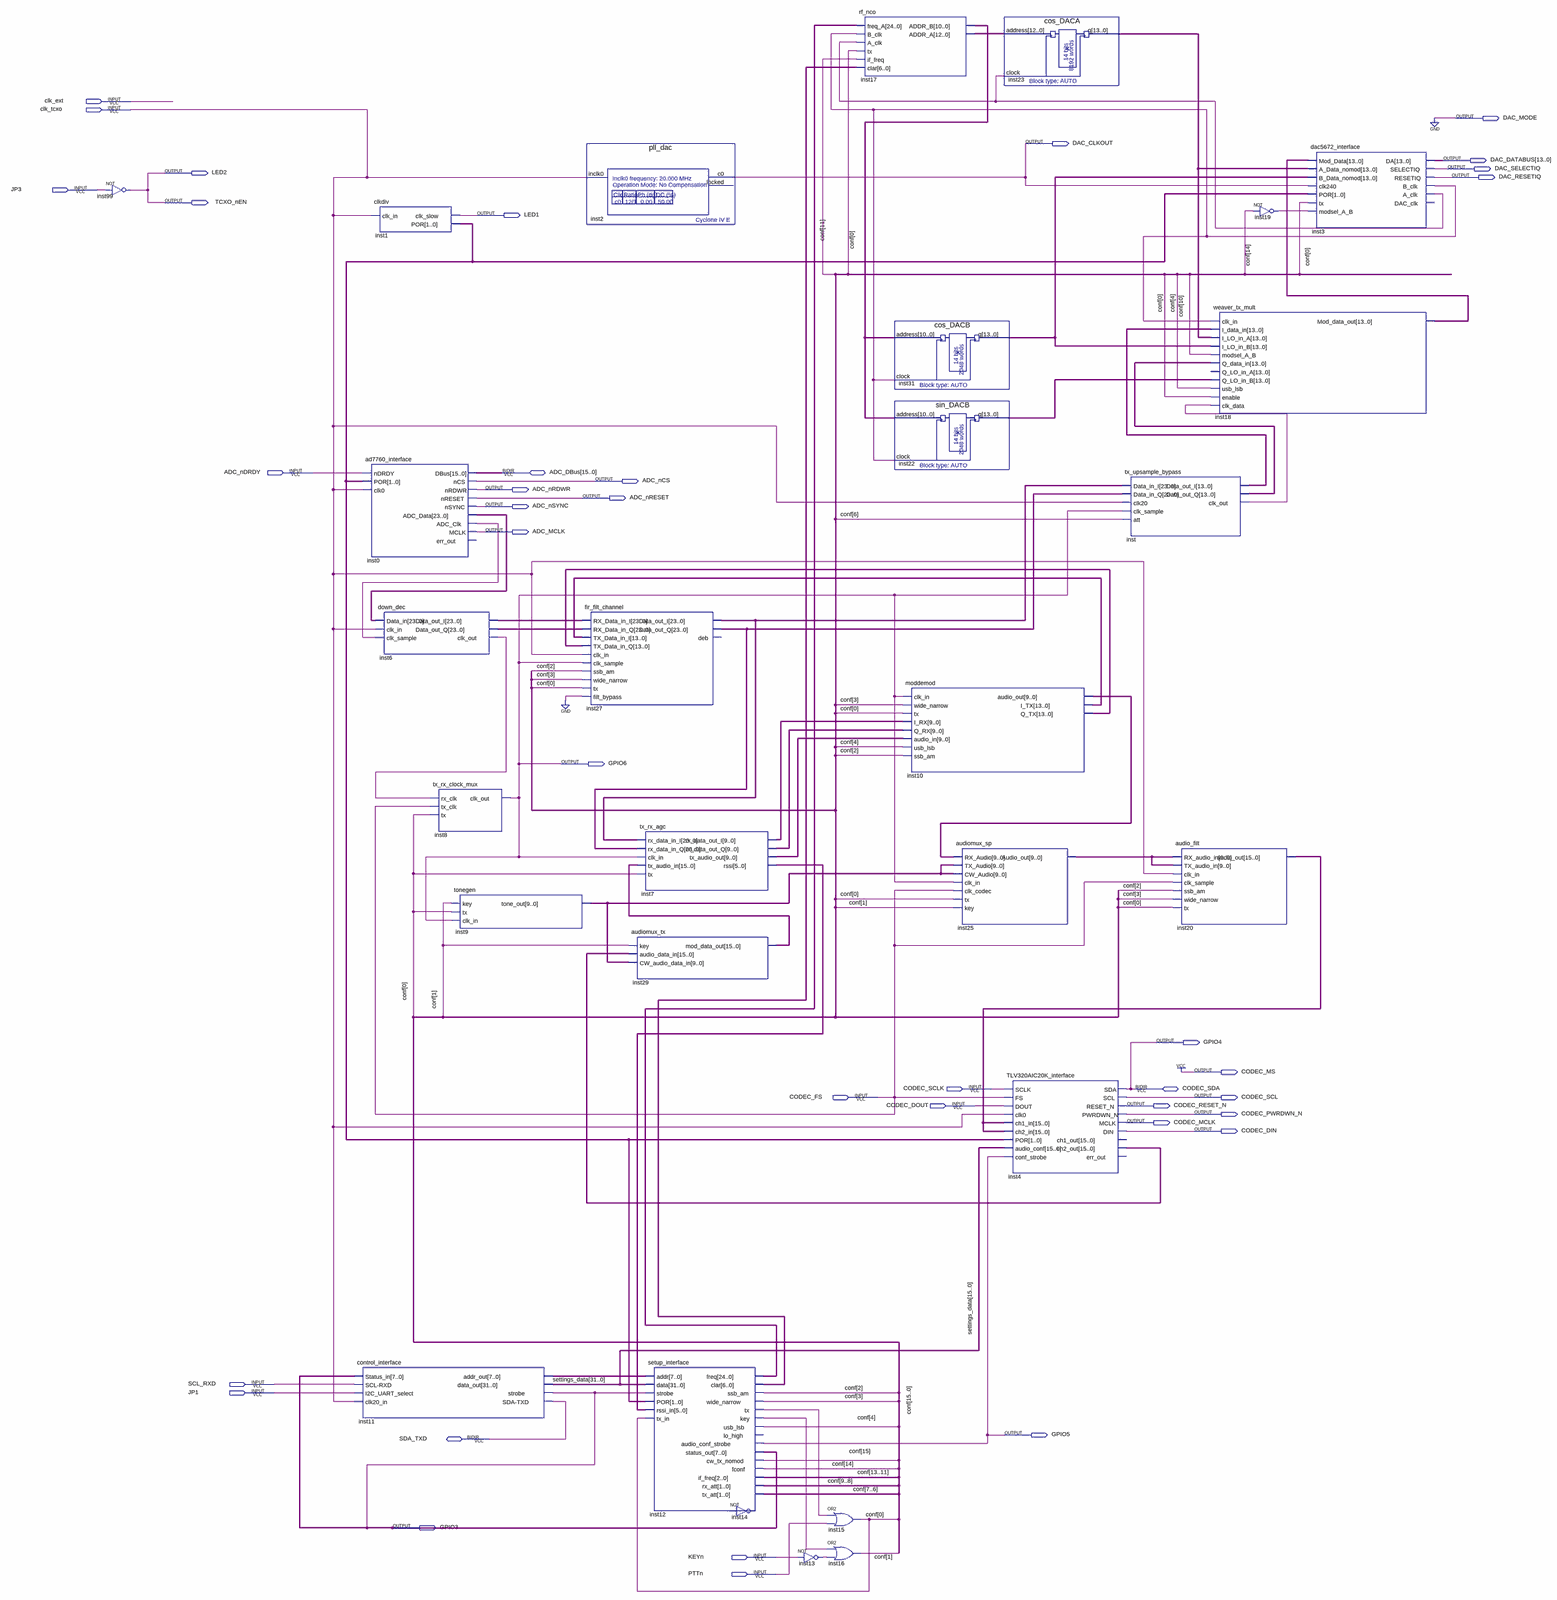
[diagram p0: schematic sheet, whole]
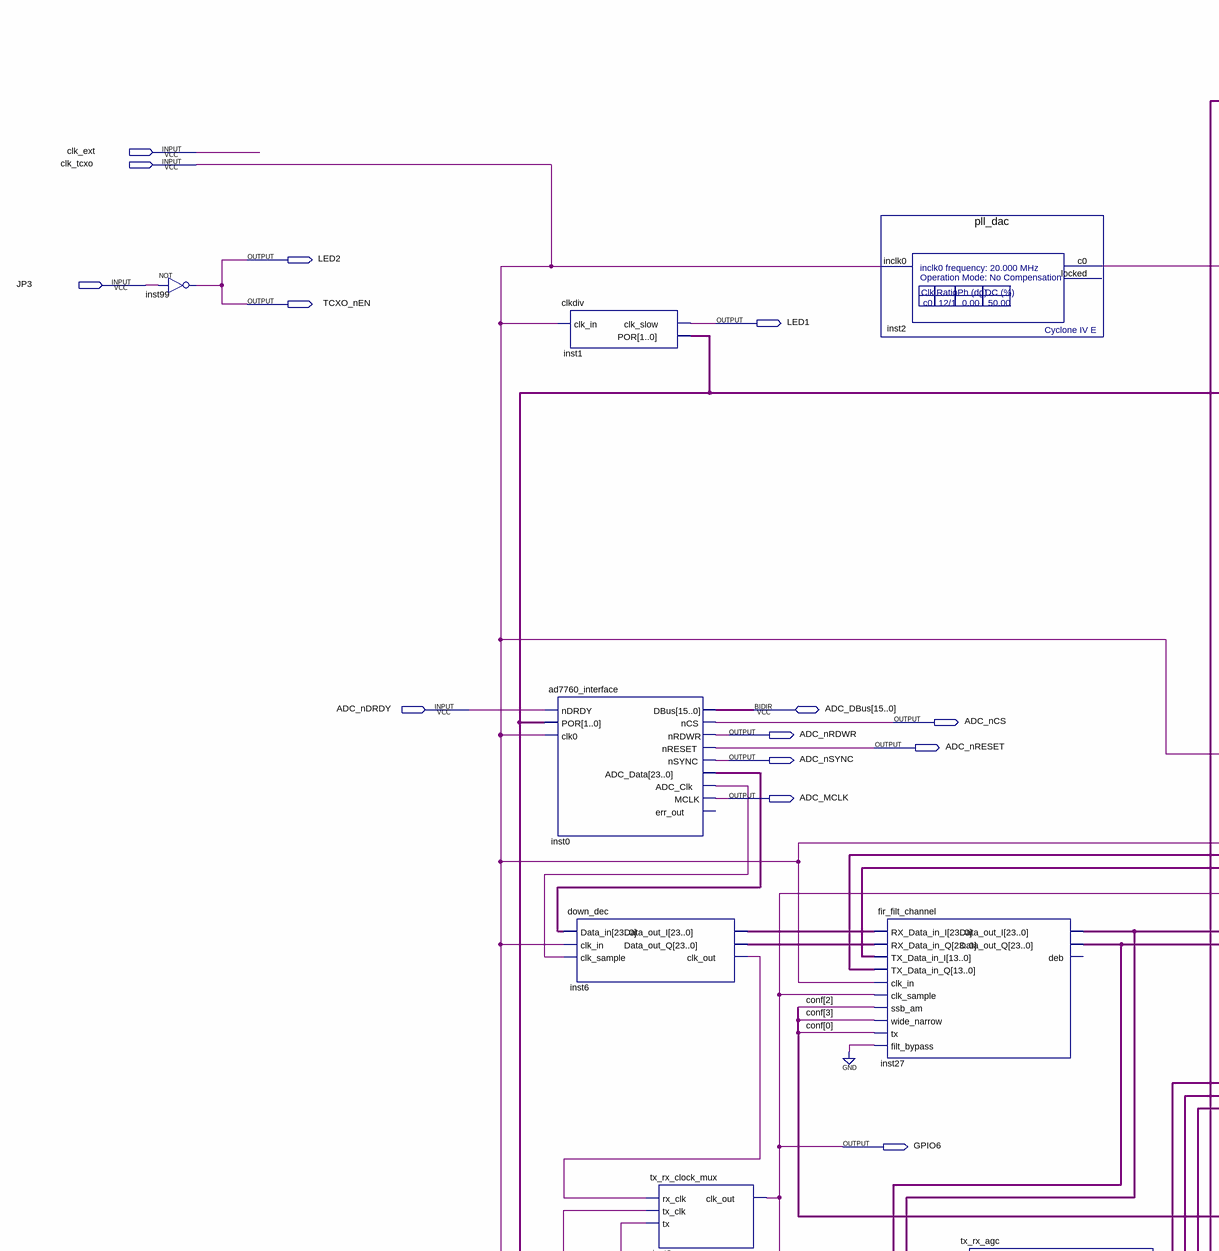
[diagram p1: schematic sheet, upper left part]
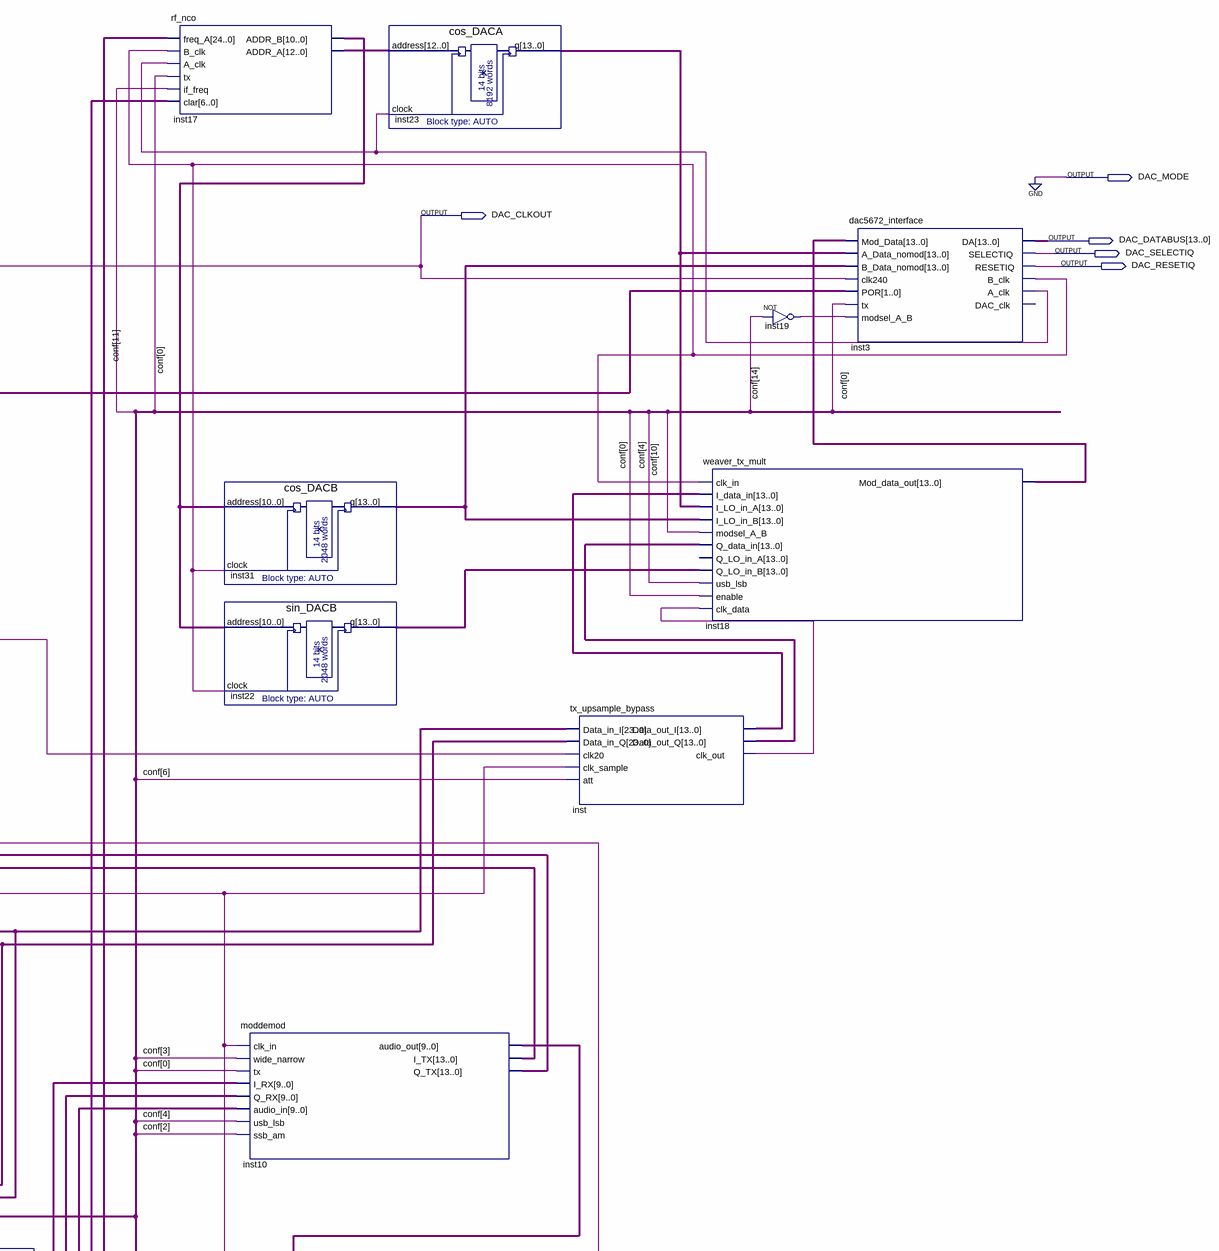
[diagram p2: schematic sheet, upper right part]
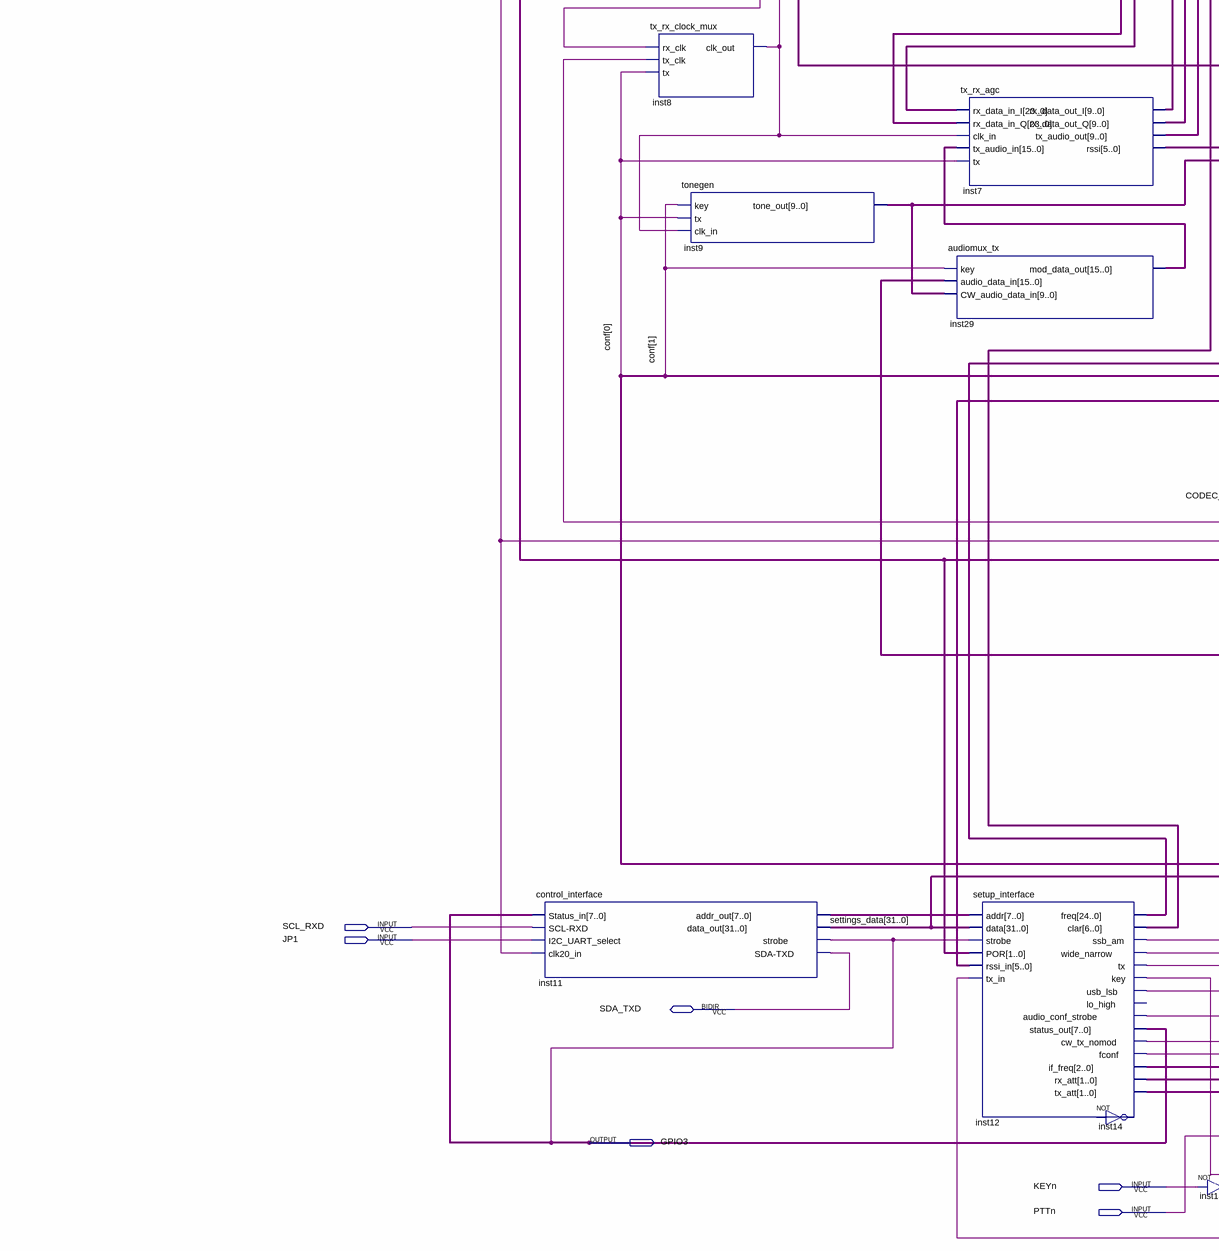
[diagram p3: schematic sheet, lower left part]
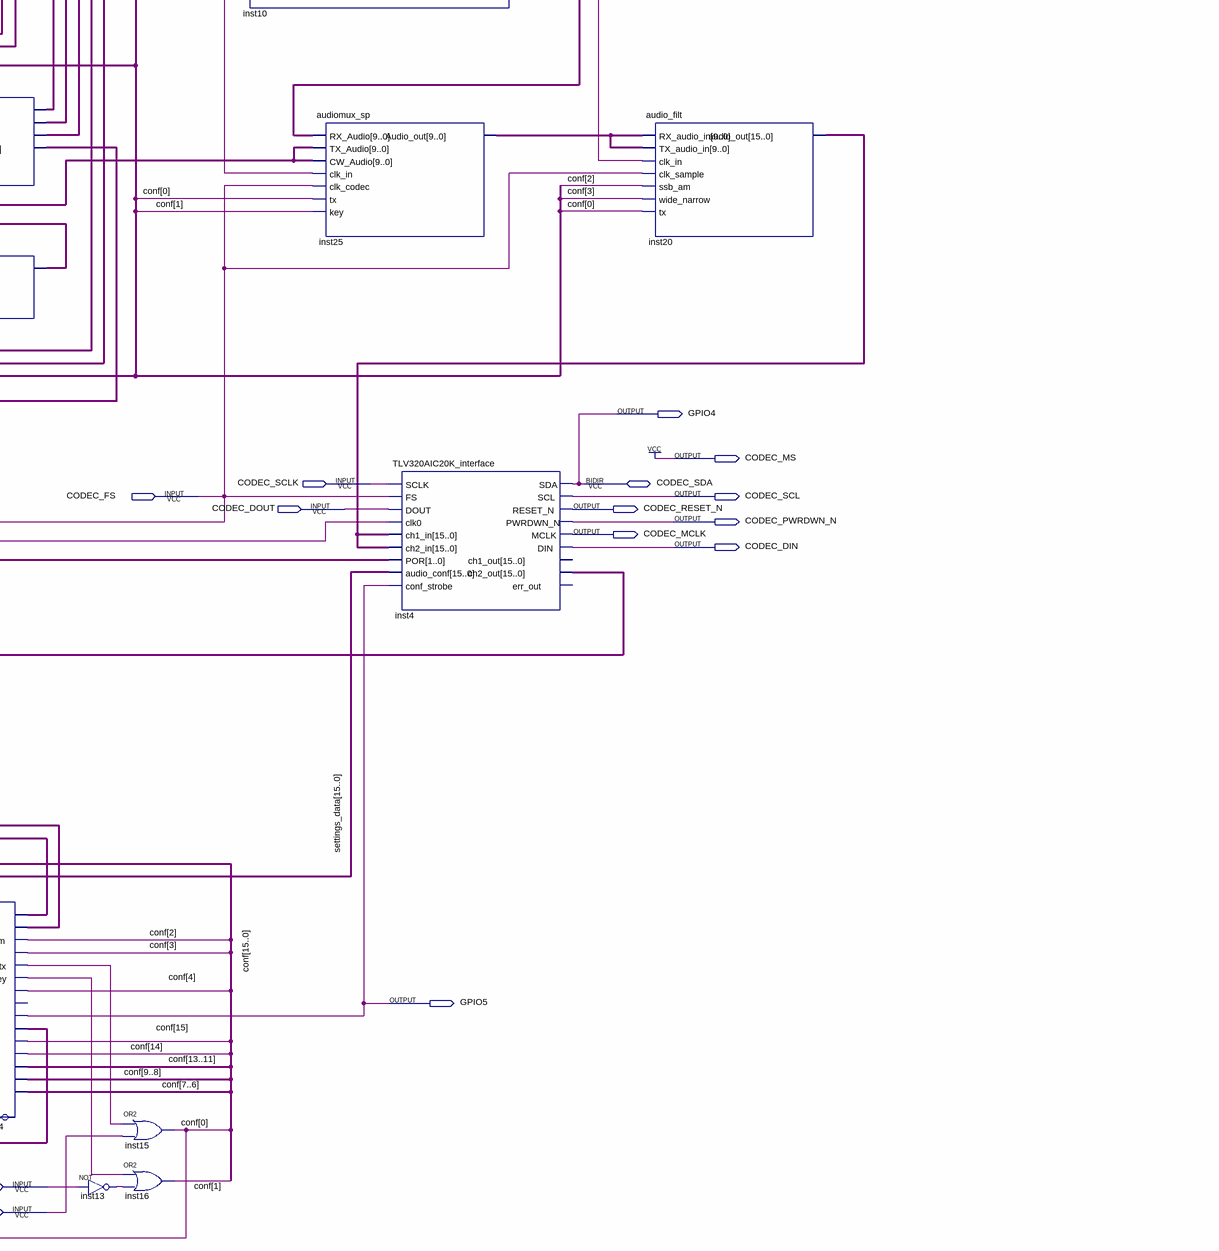
[diagram p4: schematic sheet, lower right part]
// Quartus schematic trx.bdf as structural Verilog: 28 symbols, 37 pins
module trx (
  input  clk_ext,
  input  clk_tcxo,
  input  JP3,
  input  ADC_nDRDY,
  input  CODEC_SCLK,
  input  CODEC_FS,
  input  CODEC_DOUT,
  input  SCL_RXD,
  input  JP1,
  input  KEYn,
  input  PTTn,
  inout  [15:0] ADC_DBus,
  inout  CODEC_SDA,
  inout  SDA_TXD,
  output DAC_MODE,
  output DAC_CLKOUT,
  output [13:0] DAC_DATABUS,
  output DAC_SELECTIQ,
  output LED2,
  output DAC_RESETIQ,
  output TCXO_nEN,
  output LED1,
  output ADC_nCS,
  output ADC_nRDWR,
  output ADC_nRESET,
  output ADC_nSYNC,
  output ADC_MCLK,
  output GPIO6,
  output GPIO4,
  output CODEC_MS,
  output CODEC_SCL,
  output CODEC_RESET_N,
  output CODEC_PWRDWN_N,
  output CODEC_MCLK,
  output CODEC_DIN,
  output GPIO5,
  output GPIO3
);

  wire inst0_adc_clk, inst3_a_clk, inst3_b_clk, inst6_clk_out, inst11_strobe, inst12_key, inst12_tx,
       inst13_out, inst19_out, inst_clk_out;
  wire [1:0] inst1_por;
  wire [5:0] inst7_rssi;
  wire [6:0] inst12_clar;
  wire [7:0] inst11_addr_out, inst12_status_out;
  wire [9:0] inst7_rx_data_out_i, inst7_rx_data_out_q, inst7_tx_audio_out, inst9_tone_out, inst10_audio_out,
       inst25_audio_out;
  wire [10:0] inst17_addr_b;
  wire [12:0] inst17_addr_a;
  wire [13:0] inst10_i_tx, inst10_q_tx, inst18_mod_data_out, inst22_q, inst23_q, inst31_q, inst_data_out_i,
       inst_data_out_q;
  wire [15:0] conf, inst4_ch2_out, inst20_audio_out, inst29_mod_data_out;
  wire [23:0] inst0_adc_data, inst6_data_out_i, inst6_data_out_q, inst27_data_out_i, inst27_data_out_q;
  wire [24:0] inst12_freq;
  wire [31:0] settings_data;

  not inst99 (LED2, JP3);
  clkdiv inst1 (.clk_in(clk_tcxo), .clk_slow(LED1), .POR(inst1_por));
  ad7760_interface inst0 (
    .nDRDY(ADC_nDRDY), .POR(inst1_por), .clk0(clk_tcxo), .nCS(ADC_nCS), .nRDWR(ADC_nRDWR),
    .nRESET(ADC_nRESET), .nSYNC(ADC_nSYNC), .ADC_Data(inst0_adc_data), .ADC_Clk(inst0_adc_clk),
    .MCLK(ADC_MCLK), .DBus(ADC_DBus));  // open: err_out
  control_interface inst11 (
    .Status_in(inst12_status_out), .\SCL-RXD (SCL_RXD), .I2C_UART_select(JP1), .clk20_in(clk_tcxo),
    .addr_out(inst11_addr_out), .data_out(settings_data), .strobe(inst11_strobe), .\SDA-TXD (SDA_TXD));
  down_dec inst6 (
    .Data_in(inst0_adc_data), .clk_in(clk_tcxo), .clk_sample(inst0_adc_clk), .Data_out_I(inst6_data_out_i),
    .Data_out_Q(inst6_data_out_q), .clk_out(inst6_clk_out));
  tx_rx_clock_mux inst8 (.rx_clk(inst6_clk_out), .tx_clk(CODEC_FS), .tx(conf[0]), .clk_out(GPIO6));
  tonegen inst9 (.key(conf[1]), .tx(conf[0]), .clk_in(GPIO6), .tone_out(inst9_tone_out));
  pll_dac inst2 (.inclk0(clk_tcxo), .c0(DAC_CLKOUT));  // open: locked
  fir_filt_channel inst27 (
    .RX_Data_in_I(inst6_data_out_i), .RX_Data_in_Q(inst6_data_out_q), .TX_Data_in_I(inst10_i_tx),
    .TX_Data_in_Q(inst10_q_tx), .clk_in(clk_tcxo), .clk_sample(GPIO6), .ssb_am(conf[2]),
    .wide_narrow(conf[3]), .tx(conf[0]), .filt_bypass(1'b0), .Data_out_I(inst27_data_out_i),
    .Data_out_Q(inst27_data_out_q));  // open: deb
  tx_rx_agc inst7 (
    .rx_data_in_I(inst27_data_out_i), .rx_data_in_Q(inst27_data_out_q), .clk_in(GPIO6),
    .tx_audio_in(inst29_mod_data_out), .tx(conf[0]), .rx_data_out_I(inst7_rx_data_out_i),
    .rx_data_out_Q(inst7_rx_data_out_q), .tx_audio_out(inst7_tx_audio_out), .rssi(inst7_rssi));
  audiomux_tx inst29 (
    .key(conf[1]), .audio_data_in(inst4_ch2_out), .CW_audio_data_in(inst9_tone_out),
    .mod_data_out(inst29_mod_data_out));
  setup_interface inst12 (
    .addr(inst11_addr_out), .data(settings_data), .strobe(inst11_strobe), .POR(inst1_por),
    .rssi_in(inst7_rssi), .tx_in(conf[0]), .freq(inst12_freq), .clar(inst12_clar), .ssb_am(conf[2]),
    .wide_narrow(conf[3]), .tx(inst12_tx), .key(inst12_key), .usb_lsb(conf[4]), .audio_conf_strobe(GPIO5),
    .status_out(inst12_status_out), .cw_tx_nomod(conf[15]), .fconf(conf[14]), .if_freq(conf[13:11]),
    .rx_att(conf[9:8]), .tx_att(conf[7:6]));  // open: lo_high
  // NOT inst14 is placed but not wired
  not inst13 (inst13_out, KEYn);
  or inst15 (conf[0], inst12_tx, PTTn);
  or inst16 (conf[1], inst12_key, inst13_out);
  rf_nco inst17 (
    .freq_A(inst12_freq), .B_clk(inst3_b_clk), .A_clk(inst3_a_clk), .tx(conf[0]), .if_freq(conf[11]),
    .clar(inst12_clar), .ADDR_B(inst17_addr_b), .ADDR_A(inst17_addr_a));
  cos_DACB inst31 (.address(inst17_addr_b), .clock(inst3_b_clk), .q(inst31_q));
  sin_DACB inst22 (.address(inst17_addr_b), .clock(inst3_b_clk), .q(inst22_q));
  moddemod inst10 (
    .clk_in(GPIO6), .wide_narrow(conf[3]), .tx(conf[0]), .I_RX(inst7_rx_data_out_i),
    .Q_RX(inst7_rx_data_out_q), .audio_in(inst7_tx_audio_out), .usb_lsb(conf[4]), .ssb_am(conf[2]),
    .audio_out(inst10_audio_out), .I_TX(inst10_i_tx), .Q_TX(inst10_q_tx));
  audiomux_sp inst25 (
    .RX_Audio(inst10_audio_out), .TX_Audio(inst9_tone_out), .CW_Audio(inst9_tone_out), .clk_in(GPIO6),
    .clk_codec(CODEC_FS), .tx(conf[0]), .key(conf[1]), .Audio_out(inst25_audio_out));
  cos_DACA inst23 (.address(inst17_addr_a), .clock(inst3_a_clk), .q(inst23_q));
  TLV320AIC20K_interface inst4 (
    .SCLK(CODEC_SCLK), .FS(CODEC_FS), .DOUT(CODEC_DOUT), .clk0(clk_tcxo), .ch1_in(inst20_audio_out),
    .ch2_in(inst20_audio_out), .POR(inst1_por), .audio_conf(settings_data[15:0]), .conf_strobe(GPIO5),
    .SCL(CODEC_SCL), .RESET_N(CODEC_RESET_N), .PWRDWN_N(CODEC_PWRDWN_N), .MCLK(CODEC_MCLK), .DIN(CODEC_DIN),
    .ch2_out(inst4_ch2_out), .SDA(CODEC_SDA));  // open: ch1_out, err_out
  tx_upsample_bypass inst (
    .Data_in_I(inst27_data_out_i), .Data_in_Q(inst27_data_out_q), .clk20(clk_tcxo), .clk_sample(GPIO6),
    .att(conf[6]), .Data_out_I(inst_data_out_i), .Data_out_Q(inst_data_out_q), .clk_out(inst_clk_out));
  audio_filt inst20 (
    .RX_audio_in(inst25_audio_out), .TX_audio_in(inst25_audio_out), .clk_in(clk_tcxo), .clk_sample(CODEC_FS),
    .ssb_am(conf[2]), .wide_narrow(conf[3]), .tx(conf[0]), .audio_out(inst20_audio_out));
  weaver_tx_mult inst18 (
    .clk_in(inst3_b_clk), .I_data_in(inst_data_out_i), .I_LO_in_A(inst23_q), .I_LO_in_B(inst31_q),
    .modsel_A_B(conf[10]), .Q_data_in(inst_data_out_q), .Q_LO_in_B(inst22_q), .usb_lsb(conf[4]),
    .enable(conf[0]), .clk_data(inst_clk_out), .Mod_data_out(inst18_mod_data_out));  // open: Q_LO_in_A
  not inst19 (inst19_out, conf[14]);
  dac5672_interface inst3 (
    .Mod_Data(inst18_mod_data_out), .A_Data_nomod(inst23_q), .B_Data_nomod(inst31_q), .clk240(DAC_CLKOUT),
    .POR(inst1_por), .tx(conf[0]), .modsel_A_B(inst19_out), .DA(DAC_DATABUS), .SELECTIQ(DAC_SELECTIQ),
    .RESETIQ(DAC_RESETIQ), .B_clk(inst3_b_clk), .A_clk(inst3_a_clk));  // open: DAC_clk

  assign CODEC_MS = 1'b1;
  assign DAC_MODE = 1'b0;
  assign GPIO4 = CODEC_SDA;
  assign TCXO_nEN = LED2;
endmodule
